# Altium project DD_Current_Sense.PrjPcb
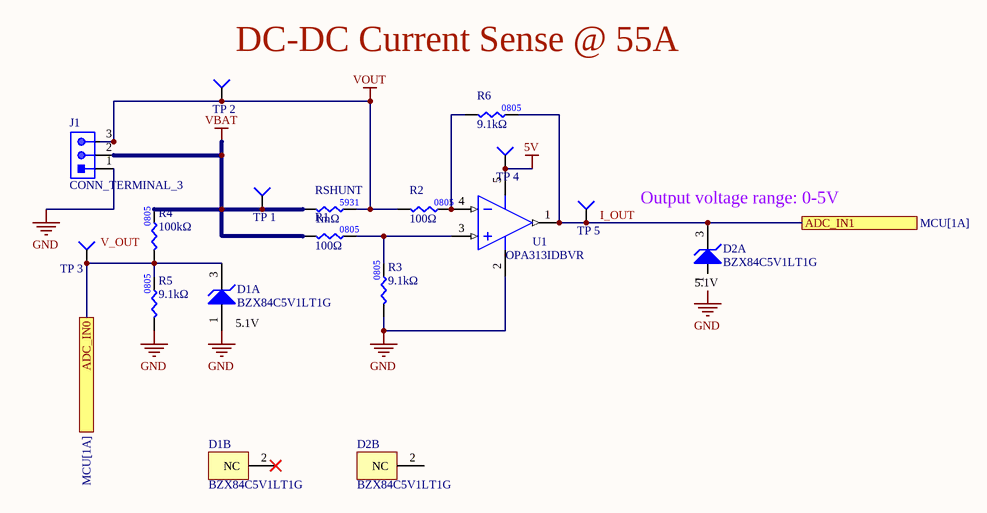
[diagram p0: DD_Current_Sense.SchDoc]
3 sheets, 61 parts. Net scope: flat (ports and power ports of the same name join across sheets).
Board file: DD_Current_Sense.PcbDoc
Sheets:
  DD_Current_Sense.SchDoc
  MCU.SchDoc
  Power.SchDoc

## Sheet DD_Current_Sense.SchDoc
size A4; SheetNumber: 1; SheetTotal: 3

### Parts
D1  BZX84C5V1LT1G  [ONSC-SOT-23-3-318-08_V]  (parts A,B of 2)
D2  BZX84C5V1LT1G  [ONSC-SOT-23-3-318-08_V]  (parts A,B of 2)
J1  CONN_TERMINAL_3  [WJ127-5.0-3P]
R1  value 100Ω  [RES0805]  (hidden comment: RES_100Ω_0805_1%)
R2  value 100Ω  [RES0805]  (hidden comment: RES_100Ω_0805_1%)
R3  value 9.1kΩ  [RES0805]  (hidden comment: RES_9.1kΩ_0805_5%)
R4  value 100kΩ  [RES0805]  (hidden comment: RES_100kΩ_0805_0.5%)
R5  value 9.1kΩ  [RES0805]  (hidden comment: RES_9.1kΩ_0805_5%)
R6  value 9.1kΩ  [RES0805]  (hidden comment: RES_9.1kΩ_0805_5%)
RSHUNT  value 1mΩ  [RES-5931]  (hidden comment: RES_1mΩ_5931_1%)
TP_1  TESTPOINT_1MM_CIRCLE  [TESTPOINT_CIRCLE_1MM]  (value not drawn)  (no BOM)
TP_2  TESTPOINT_1MM_CIRCLE  [TESTPOINT_CIRCLE_1MM]  (value not drawn)  (no BOM)
TP_3  TESTPOINT_1MM_CIRCLE  [TESTPOINT_CIRCLE_1MM]  (value not drawn)  (no BOM)
TP_4  TESTPOINT_1MM_CIRCLE  [TESTPOINT_CIRCLE_1MM]  (value not drawn)  (no BOM)
TP_5  TESTPOINT_1MM_CIRCLE  [TESTPOINT_CIRCLE_1MM]  (value not drawn)  (no BOM)
U1  Manufacturer Part Number 1: OPA313IDBVR  [DBV0005A_M]  (hidden comment: OPAMP_OPA313IDBVR)

### Ports
ADC_IN0 (see MCU[1A]), ADC_IN1 (see MCU[1A])

### Nets
5V: TP_4.1(=value) U1.5(V+)
GND: D1.1(A) D2.1(A) J1.1 R3.1 R5.1 U1.2(V-)
VBAT: J1.2 R1.1 R4.2 RSHUNT.1 TP_1.1(=value)
VOUT: J1.3 R2.1 RSHUNT.2 TP_2.1(=value)
NetD1_3: D1.3(K) R4.1 R5.2 TP_3.1(=value) ; port ADC_IN0
NetD2_3: D2.3(K) R6.2 TP_5.1(=value) U1.1(OUT) ; port ADC_IN1
NetR1_2: R1.2 R3.2 U1.3(IN+)
NetR2_2: R2.2 R6.1 U1.4(IN-)

Not connected (* = marked no-connect by the designer): D1 2(NC)*; D2 2(NC)

### Notes on the sheet
- (near TP_2) DC-DC Current Sense @ 55A
- (near TP_5) I_OUT
- Output voltage range: 0-5V
- V_OUT
- (near D2) 5.1V
- (near D1) 5.1V
- (in symbol RES_100kΩ_0805_0.5%) 0805

### Library data of the parts
D1 D2 = CMP-1060-00946-1: Zener Voltage Regulator, 225 mW, 3-Pin SOT-23, Pb-Free, Tape and Reel; Manufacturer: On Semiconductor; Mounting Technology: Surface Mount; ComponentLink1URL: http://www.onsemi.com/; PartNumber: BZX84C5V1LT1G; DatasheetVersion: Rev. 17; PackageDescription: 3-Pin Small Outline Transistor, Body 2.92 x 1.3 mm, Pitch 0.95 mm; ComponentLink2Description: Datasheet; PackageVersion: Rev. AP, 11/2009; PackageReference: SOT-23-3-318-08; ComponentLink3Description: Package Specification; RoHS: Pb-Free; ComponentLink3URL: http://www.onsemi.cn/pub_link/Collateral/318-08.PDF; ComponentLink2URL: http://www.onsemi.com/pub_link/Collateral/BZX84C2V4LT1-D.PDF; Packing: Tape and Reel; ComponentLink1Description: Manufacturer URL
J1 = CONN_TERMINAL_3: Header, 3-Pin; Manufacturer 1: Ningbo Kangnex; LCSC Number: C8393; Manufaturer Part Number 1: WJ127-5.0-3P; Datasheet: https://datasheet.lcsc.com/lcsc/2107141401_Ningbo-Kangnex-Elec-WJ127-5-0-3P_C8393.pdf; Supplier 1: LCSC
R1 R2 = RES_100Ω_0805_1%: RES 100 OHM 1% 1/8W 0805; Manufacturer 1: Vishay Dale; Manufacturer Part Number 1: CRCW0805100RFKEA; Package/Footprint: 0805; Supplier 1: Digi-Key; Mounting Type: SMD; Supplier Part Number 1: 541-100CCT-ND; LCSC Part #: C1790
R3 R5 R6 = RES_9.1kΩ_0805_5%: RES 9.1K OHM 5% 1/8W 0805; Manufacturer 1: Yageo; Manufacturer Part Number 1: RC0805JR-079K1L; Supplier 1: Digi-Key; Supplier Part Number 1: 311-9.1KARCT-ND; Tolerance: 5%; Package: 0805
R4 = RES_100kΩ_0805_0.5%: RES 100K OHM 0.5% 1/8W 0805; Manufacturer 1: Panasonic; Manufacturer Part Number 1: ERA-6AED104V; Supplier 1: Digi-Key; Supplier Part Number 1: P123795CT-ND
RSHUNT = RES_1mΩ_5931_1%: RES 0.001 OHM 1% 10W 5931; Manufacturer 1: Vishay Dale; Manufacturer Part Number 1: WSLP59311L000FEA; Supplier Part Number 1: 541-10012-1-ND; Supplier 1: Digi-Key; Mounting Type: SMD; Package: 5931
TP_1-TP_5 = TESTPOINT_1MM_CIRCLE: TESTPOINT 1MM CIRCLE
U1 = OPAMP_OPA313IDBVR: IC OPAMP GP 1 CIRCUIT SOT23-5; Manufacturer 1: Texas Instruments; Package: SOT-23-5; Mounting Type: SMD; Supplier Part Number 1: 296-35607-1-ND; Supplier 1: Digi-Key; Verified: No

## Sheet MCU.SchDoc
size A4; SheetNumber: 2; SheetTotal: 3
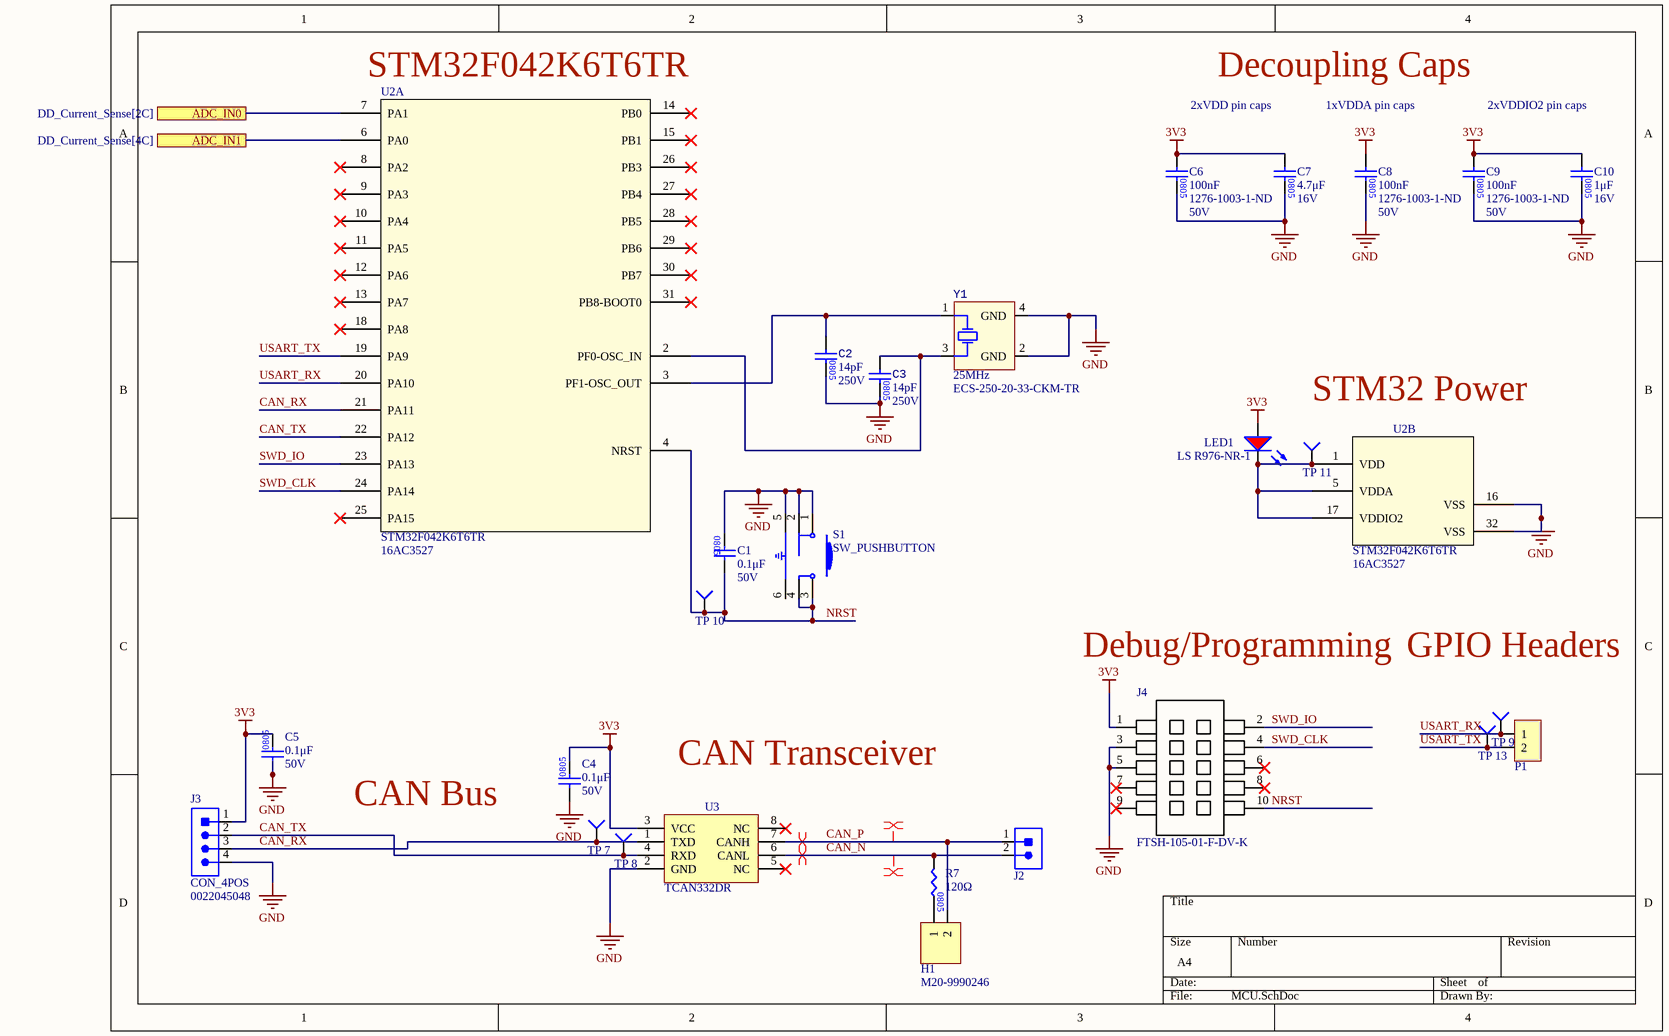
[diagram p1: MCU.SchDoc]

### Parts
C1  value 0.1μF  Voltage Rating: 50V  [CAP2012]  (hidden comment: CAP_0.1uF_50V_0805)
C2  value 14pF  Voltage Rating: 250V  [CAP0805]  (hidden comment: CAP_14pF_50V_0805)
C3  value 14pF  Voltage Rating: 250V  [CAP0805]  (hidden comment: CAP_14pF_50V_0805)
C4  value 0.1μF  Voltage Rating: 50V  [CAP0805]  (hidden comment: CAP_0.1uF_50V_0805)
C5  value 0.1μF  Voltage Rating: 50V  [CAP0805]  (hidden comment: CAP_0.1uF_50V_0805)
C6  value 100nF  Supplier Part Number 1: 1276-1003-1-ND  Voltage Rating: 50V  [CAP0805]  (hidden comment: CAP_100nF_50V_0805)
C7  value 4.7μF  Voltage Rating: 16V  [CAP0805]  (hidden comment: CAP_4.7uF_16V_0805)
C8  value 100nF  Supplier Part Number 1: 1276-1003-1-ND  Voltage Rating: 50V  [CAP0805]  (hidden comment: CAP_100nF_50V_0805)
C9  value 100nF  Supplier Part Number 1: 1276-1003-1-ND  Voltage Rating: 50V  [CAP0805]  (hidden comment: CAP_100nF_50V_0805)
C10  value 1μF  Voltage Rating: 16V  [CAP0805]  (hidden comment: CAP_1uF_16V_0805)
H1  Manufacturer Part Number 1: M20-9990246  [HDR1X2]  (hidden comment: HEADER)
J2  CON_2POS_SCREW_TERM  [1935161]  (value not drawn)
J3  CON_4POS  Manufacturer Part Number: 0022045048
J4  Manufacturer Part Number 1: FTSH-105-01-F-DV-K  [FTSH-105-01-F-DV-K-P-TR]  (hidden comment: CON_PROGRAMMING)
LED1  Manufacturer Part Number 1: LS R976-NR-1  [LED_0805_RED]  (hidden comment: LED_RED)
P1  CONN_TERMINAL_2  [OSTYK51102030]  (value not drawn)
R7  value 120Ω  [RES0805]  (hidden comment: RES_120Ω_0805_1%)
S1  SW_PUSHBUTTON  [TACTILE_SWITCH_SMD]
TP_7  TESTPOINT_1MM_CIRCLE  [TESTPOINT_CIRCLE_1MM]  (value not drawn)  (no BOM)
TP_8  TESTPOINT_1MM_CIRCLE  [TESTPOINT_CIRCLE_1MM]  (value not drawn)  (no BOM)
TP_9  TESTPOINT_1MM_CIRCLE  [TESTPOINT_CIRCLE_1MM]  (value not drawn)  (no BOM)
TP_10  TESTPOINT_1MM_CIRCLE  [TESTPOINT_CIRCLE_1MM]  (value not drawn)  (no BOM)
TP_11  TESTPOINT_1MM_CIRCLE  [TESTPOINT_CIRCLE_1MM]  (value not drawn)  (no BOM)
TP_13  TESTPOINT_1MM_CIRCLE  [TESTPOINT_CIRCLE_1MM]  (value not drawn)  (no BOM)
U2  STM32F042K6T6TR  Supplier Part Number 1: 16AC3527  [LQFP-32]  (parts A,B of 2)
U3  TCAN332DR  [SOIC127P599X175-8N]
Y1  Frequency: 25MHz  Manufacturer Part Number 1: ECS-250-20-33-CKM-TR  [XTAL_ECS-250-20-33-CKM-TR]  (hidden comment: CRYSTAL_25MHZ_20PF)

### Ports
ADC_IN0 (see DD_Current_Sense[2C]), ADC_IN1 (see DD_Current_Sense[4C])

### Nets
3V3: C4.2 C5.2 C6.1 C7.1 C8.1 C9.1 C10.1 J3.1 J4.1 LED1.1(A) U3.3(VCC)
GND: C1.1 C2.2 C3.2 C4.1 C5.1 C6.2 C7.2 C8.2 C9.2 C10.2 J3.4 J4.3 J4.5 S1.1 S1.2 S1.5 U2.16(VSS) U2.32(VSS) U3.2(GND) Y1.2(GND) Y1.4(GND)
CAN_N: J2.2 R7.1 U3.6(CANL)
CAN_P: H1.2 J2.1 U3.7(CANH)
CAN_RX: J3.3 TP_7.1(=value) U2.21(PA11) U3.1(TXD)
CAN_TX: J3.2 TP_8.1(=value) U2.22(PA12) U3.4(RXD)
NRST: C1.2 J4.10 S1.3 S1.4 TP_10.1(=value) U2.4(NRST)
SWD_CLK: J4.4 U2.24(PA14)
SWD_IO: J4.2 U2.23(PA13)
USART_RX: P1.1 TP_9.1(=value) U2.20(PA10)
USART_TX: P1.2 TP_13.1(=value) U2.19(PA9)
NetC2_1: C2.1 U2.3(PF1-OSC_OUT) Y1.1(HOT)
NetC3_1: C3.1 U2.2(PF0-OSC_IN) Y1.3(HOT)
NetD1_3: U2.7(PA1) ; port ADC_IN0
NetD2_3: U2.6(PA0) ; port ADC_IN1
NetH1_1: H1.1 R7.2
NetLED1_2: LED1.2(K) TP_11.1(=value) U2.1(VDD) U2.5(VDDA) U2.17(VDDIO2)

Not connected (* = marked no-connect by the designer): J4 6* 7* 8* 9*; S1 6; U2 8(PA2)* 9(PA3)* 10(PA4)* 11(PA5)* 12(PA6)* 13(PA7)* 14(PB0)* 15(PB1)* 18(PA8)* 25(PA15)* 26(PB3)* 27(PB4)* 28(PB5)* 29(PB6)* 30(PB7)* 31(PB8-BOOT0)*; U3 5(NC)* 8(NC)*

### Layout directives
differential pair: CAN_N, CAN_P

### Notes on the sheet
- (near U2) STM32F042K6T6TR
- 2xVDD pin caps
- Decoupling Caps
- 1xVDDA pin caps
- 2xVDDIO2 pin caps
- STM32 Power
- Debug/Programming
- GPIO Headers
- CAN Transceiver
- CAN Bus

### Library data of the parts
C1 = CAP_0.1uF_50V_0805: CAP CER 0.1UF 50V X7R 0805; Manufacturer Part Number 1: GCM21BR71H104KA37K; Manufacturer 1: Murata Electronics; Package/Footprint: 0805; Supplier Part Number 1: 490-8049-1-ND; Supplier 1: Digi-Key; Dielectric: X7R; LCSC Part #: C49678; Mounting Type: SMD
C2 C3 = CAP_14pF_50V_0805: CERAMIC CAP MLCC HIGH-Q 125C; Manufacturer: Murata Electronics; Manufacturer Part Number: GQM2195C2E140JB12D; Mounting Type: SMD; Package: 0805; Supplier 1: Digi-Key; Supplier Part Number 1: 490-GQM2195C2E140JB12DCT-ND
C4 C5 = CAP_0.1uF_50V_0805: CAP CER 0.1UF 50V X7R 0805; Manufacturer 1: Murata Electronics; Manufacturer Part Number 1: GCM21BR71H104KA37K; Package/Footprint: 0805; Mounting Type: SMD; Supplier 1: Digi-Key; Supplier Part Number 1: 490-8049-1-ND; Dielectric: X7R; LCSC Part #: C49678
C6 C8 C9 = CAP_100nF_50V_0805: CAP CER 0.1UF 50V X7R 0805; Manufacturer 1: Samsung Electro-Mechanics; Manufacturer Part Number 1: CL21B104KBCNNNC; Package/Footprint: 0805; Supplier 1: Digi-Key
C7 = CAP_4.7uF_16V_0805: CAP CER 4.7UF 16V X5R 0805; Manufacturer 1: Samsung Electro-Mechanics; Manufacturer Part Number 1: CL21A475KOFNNNE; Mounting Type: SMD; Supplier 1: Digi-Key; Supplier Part Number 1: 1276-1065-1-ND; Package: 0805; LCSC Part #: C1779; Dielectric: X5R
C10 = CAP_1uF_16V_0805: CAP CER 1UF 16V X7R 0805; Manufacturer 1: Yageo; Manufacturer Part Number 1: CC0805KKX7R7BB105; Mounting Type: SMD; Supplier 1: Digi-Key; Supplier Part Number 1: 311-1365-1-ND; Package: 0805; Dielectric: X7R
H1 = HEADER: HEADER 2X1; Manufacturer 1: Harwin Inc.; Package/Footprint: TH; Mounting Type: TH; Supplier 1: Digi-Key; Supplier Part Number 1: 952-2262-ND
J2 = CON_2POS_SCREW_TERM: TERM BLK 2POS SIDE ENTRY 5MM; Manufacturer 1: Phoenix Contact; Package/Footprint: SMD; Supplier 1: Digi-Key; Mounting Type: TH; Supplier Part Number 1: 277-1667-ND; Manufacturer Part Number 1: 1935161
J3 = CON_4POS: CONN HEADER VERT 4POS 2.54MM; Manufacturer: Molex; Supplier 1: Digi-Key; Supplier Part Number 1: 0022045048-ND; RoHS: Yes; Category: Headers and Wire Housings; Pricing 1: 16000=0.12858 (USD); ComponentLink1URL: https://datasheet.ciiva.com/6839/022045032-sd-6839882.pdf?src-supplier=Digi-Key; ComponentLink1Description: https://datasheet.ciiva.com/6839/022045032-sd-6839882.pdf?src-supplier=Digi-Key
J4 = CON_PROGRAMMING: CONN HEADER SMD 10POS 1.27MM; Manufacturer 1: Samtec; Supplier 1: Digi-Key; Pitch: 1.27mm; Supplier Part Number 1: SAM8796-ND; Mounting Type: SMD
LED1 = LED_RED: LED RED DIFFUSED 0805 SMD; Manufacturer 1: OSRAM; Package/Footprint: 0805; Forward Voltage Drop: 2V; Forward Current: 20mA; Supplier Part Number 1: 475-1278-1-ND; Supplier 1: Digi-Key; Mounting Type: SMD
P1 = CONN_TERMINAL_2: Header, 2-Pin; Manufacturer 1: On Shore Technology Inc.; Manufacturer Part Number 1: OSTYK51102030; Supplier Part Number 1: ED2953-ND; Supplier 1: Digi-Key
R7 = RES_120Ω_0805_1%: RES 120 OHM 1% 1/8W 0805; Manufacturer 1: Vishay; Manufacturer Part Number 1: CRCW0805120RFKEA; Package/Footprint: 0805; Supplier 1: Digi-Key; Mounting Type: SMD; Supplier Part Number 1: 541-120CCT-ND; LCSC Part #: C17437
S1 = SW_PUSHBUTTON: SMT 3.0 X 2.6 MM TACT SWITCH WIT; Manufacturer 1: Würth Elektronik; Manufacturer Part Number 1: 435151014824; Supplier 1: Digi-Key; Supplier Part Number 1: 732-435151014824CT-ND
TP_7-TP_11 TP_13 = TESTPOINT_1MM_CIRCLE: TESTPOINT 1MM CIRCLE
U2 = STM32F042K6T6TR: ARM® Cortex®-M0 STM32F0 Microcontroller IC 32-Bit Single-Core 48MHz 32KB (32K x 8) FLASH 32-LQFP (7x7); Mfr_Name: STMicroelectronics; Voltage - Supply (Vcc/Vdd): 2V ~ 3.6V; Core Processor: ARM® Cortex®-M0; Core Size: 32-Bit Single-Core; Speed: 48MHz; Program Memory Size: 32KB (32K x 8); Operating Temperature: -40°C ~ 85°C (TA); Package / Case: 32-LQFP; ComponentLink1Description: digikey; ComponentLink1URL: https://www.digikey.com/en/products/detail/stmicroelectronics/STM32F042K6T6TR/10414582; Supplier 1: Avnet
U3 = TCAN332DR: IC CAN TRANSCEIVER; Manufacturer 1: Texas Instruments; Manufacturer Part Number 1: TCAN332DR; Supplier 1: Digi-Key; Supplier Part Number 1: 296-43711-1-ND
Y1 = CRYSTAL_25MHZ_20PF: CRYSTAL 25.0000MHZ 20PF SMD; Manufacturer 1: ECS Inc.; Load Capacitance: 20pF; Supplier 1: Digi-Key; Supplier Part Number 1: XC1817CT-ND; Mounting Type: SMD; Package/Footprint: SMD

## Sheet Power.SchDoc
size A4; SheetNumber: 3; SheetTotal: 3
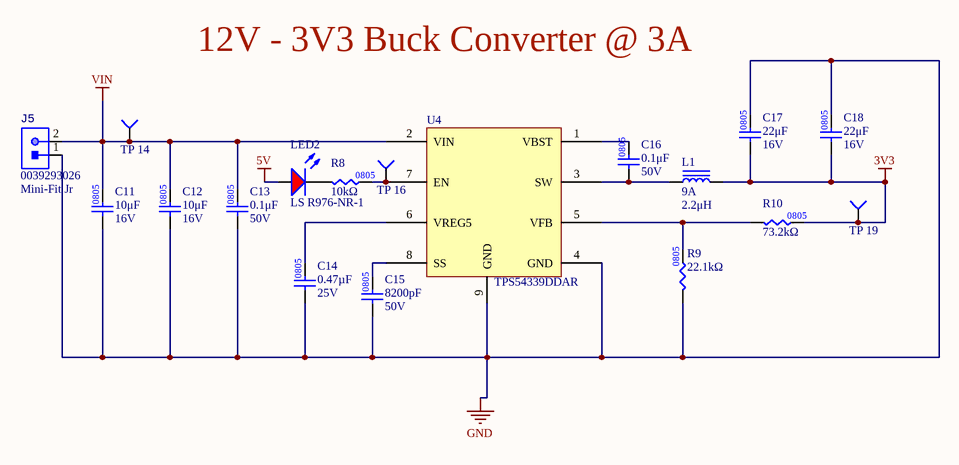
[diagram p2: Power.SchDoc]

### Parts
C11  value 10μF  Voltage Rating: 16V  [CAP0805]  (hidden comment: CAP_10uF_16V_0805)
C12  value 10μF  Voltage Rating: 16V  [CAP0805]  (hidden comment: CAP_10uF_16V_0805)
C13  value 0.1μF  Voltage Rating: 50V  [CAP0805]  (hidden comment: CAP_0.1uF_50V_0805)
C14  value 0.47µF  Voltage Rating: 25V  [CAP0805]  (hidden comment: CAP_0.47uF_25V_0805)
C15  Capacitance: 8200pF  Voltage Rating: 50V  [CAP0805]  (hidden comment: CAP_8200pF_50V_0805)
C16  value 0.1μF  Voltage Rating: 50V  [CAP0805]  (hidden comment: CAP_0.1uF_50V_0805)
C17  value 22μF  Voltage Rating: 16V  [CAP2012]  (hidden comment: CAP_22uF_16V_0805)
C18  value 22μF  Voltage Rating: 16V  [CAP2012]  (hidden comment: CAP_22uF_16V_0805)
J5  Family: Mini-Fit Jr  [0039293026]  (hidden comment: CONN_0039293026)
L1  Current Rating: 9A  Inductance: 2.2μH  [IND_BOURNS_SDR1806]  (hidden comment: IND_2.2uH_9A)
LED2  Manufacturer Part Number 1: LS R976-NR-1  [LED_0805_RED]  (hidden comment: LED_RED)
R8  value 10kΩ  [RES0805]  (hidden comment: RES_10kΩ_0805_5%)
R9  value 22.1kΩ  [RES0805]  (hidden comment: RES_22.1kΩ_0805_1%)
R10  value 73.2kΩ  [RES0805]  (hidden comment: RES_73.2kΩ_0805_1%)
TP_14  TESTPOINT_1MM_CIRCLE  [TESTPOINT_CIRCLE_1MM]  (value not drawn)  (no BOM)
TP_16  TESTPOINT_1MM_CIRCLE  [TESTPOINT_CIRCLE_1MM]  (value not drawn)  (no BOM)
TP_19  TESTPOINT_1MM_CIRCLE  [TESTPOINT_CIRCLE_1MM]  (value not drawn)  (no BOM)
U4  Manufacturer Part Number 1: TPS54339DDAR  [VREG_LM5017MR/NOPB]  (hidden comment: TPS54339)

### Nets
3V3: C17.1 C18.1 L1.2 R10.2 TP_19.1(=value)
5V: LED2.1(A)
GND: C11.1 C12.1 C13.1 C14.1 C15.1 C17.2 C18.2 J5.1 R9.1 U4.4(GND) U4.9(GND)
VIN: C11.2 C12.2 C13.2 J5.2 TP_14.1(=value) U4.2(VIN)
NetC14_2: C14.2 U4.6(VREG5)
NetC15_2: C15.2 U4.8(SS)
NetC16_1: C16.1 L1.1 U4.3(SW)
NetC16_2: C16.2 U4.1(VBST)
NetLED2_2: LED2.2(K) R8.1
NetR8_2: R8.2 TP_16.1(=value) U4.7(EN)
NetR9_2: R9.2 R10.1 U4.5(VFB)

### Notes on the sheet
- 12V - 3V3 Buck Converter @ 3A
- (in symbol RES_22.1kΩ_0805_1%) 0805

### Library data of the parts
C11 C12 = CAP_10uF_16V_0805: CAP CER 10UF 16V X5R 0805; Manufacturer 1: Yageo; Manufacturer Part Number 1: CC0805KKX5R7BB106; Package/Footprint: 0805; Mounting Type: SMD; Supplier 1: Digi-Key; Supplier Part Number 1: 311-1865-1-ND; Dielectric: X5R
C13 C16 = CAP_0.1uF_50V_0805: as C4 on sheet MCU; Mounting Type: SMD; Supplier 1: Digi-Key; Supplier Part Number 1: 490-8049-1-ND; Dielectric: X7R; LCSC Part #: C49678
C14 = CAP_0.47uF_25V_0805: CAP CER 0.47UF 25V X5R 0805; Manufacturer 1: KEMET; Manufacturer Part Number 1: C0805C474K3PAC7800; Package: 0805; Supplier 1: Digi-Key; Supplier Part Number 1: 399-15508-1-ND
C15 = CAP_8200pF_50V_0805: CAP CER 8200PF 50V X7R 0805; Manufacturer: YAGEO; Manufacturer Part Number: CC0805KRX7R9BB822; Mounting Type: SMD; Package: 0805; Supplier 1: Digi-Key; Supplier Part Number 1: 311-4331-1-ND; Dielectric: X7R
C17 C18 = CAP_22uF_16V_0805: CAP CER 22UF 16V X5R 0805; Manufacturer 1: Murata Electronics; Manufacturer Part Number 1: GRM219R61C226ME15L; Package/Footprint: 0805; Mounting Type: SMD; Supplier 1: Digi-Key; Supplier Part Number 1: 490-9952-1-ND; Dielectric: X5R
J5 = CONN_0039293026: CONN HEADER VERT 2POS MINI-FIT; Manufacturer 1: Molex; Package/Footprint: TH; Supplier 1: Digi-Key; Mounting Type: TH; Supplier Part Number 1: WM3843-ND; Verified: No; Manufacturer Part Number 1: 0039293026
L1 = IND_2.2uH_9A: INDUCTOR 2.2UH 9A 6.8 MOHM SMD; Manufacturer 1: Bourns; Manufacturer Part Number 1: SDR1806-2R2ML; Supplier 1: Digi-Key; Mounting Type: SMD; DC Resistance (DCR): 6.8mOhm; Supplier Part Number 1: SDR1806-2R2MLCT-ND
LED2 = LED_RED: as LED1 on sheet MCU; Supplier Part Number 1: 475-1278-1-ND; Supplier 1: Digi-Key; Mounting Type: SMD
R8 = RES_10kΩ_0805_5%: RES 10K OHM 5% 1/8W 0805; Manufacturer 1: Panasonic Electronic Components; Manufacturer Part Number 1: ERJ-6GEYJ103V; Package/Footprint: 0805; Supplier 1: Digi-Key; Supplier Part Number 1: P10KACT-ND; LCSC Part #: C17414; Mounting Type: SMD
R9 = RES_22.1kΩ_0805_1%: RES 22.1K OHM 1% 1/8W 0805; Manufacturer 1: Vishay Dale; Manufacturer Part Number 1: CRCW080522K1FKEA; Supplier 1: Digi-Key; Supplier Part Number 1: 541-22.1KCCT-ND
R10 = RES_73.2kΩ_0805_1%: RES 73.2K OHM 1% 1/8W 0805; Manufacturer 1: Yageo; Manufacturer Part Number 1: RC0805FR-0773K2L; Package/Footprint: 0805; Mounting Type: SMD; Supplier 1: Digi-Key; Supplier Part Number 1: 311-73.2KCRCT-ND
TP_14 TP_16 TP_19 = TESTPOINT_1MM_CIRCLE: TESTPOINT 1MM CIRCLE
U4 = TPS54339: IC REG BUCK ADJUSTABLE 3A 8SOPWR; Manufacturer 1: Texas Instruments; Input Voltage (Min): 4.5V; Input Voltage (Max): 23V; Output Voltage (Min/Fixed): 0.76V; Output Voltage (Max): 7V; Switching Frequency: 600kHz; Supplier 1: Digi-Key; Supplier Part Number 1: 296-35686-1-ND; Output Current: 3A; Package: 8-PowerSOIC

## Nets that join several sheets
3V3: MCU (11 pins), Power (5 pins)
5V: DD_Current_Sense (TP_4.1 U1.5), Power (LED2.1)
GND: DD_Current_Sense (6 pins), MCU (21 pins), Power (11 pins)
NetD1_3: DD_Current_Sense (D1.3 R4.1 R5.2 TP_3.1), MCU (U2.7)
NetD2_3: DD_Current_Sense (D2.3 R6.2 TP_5.1 U1.1), MCU (U2.6)